# EAGLE design Proto FeatherWing (EAGLE 8.5.2)
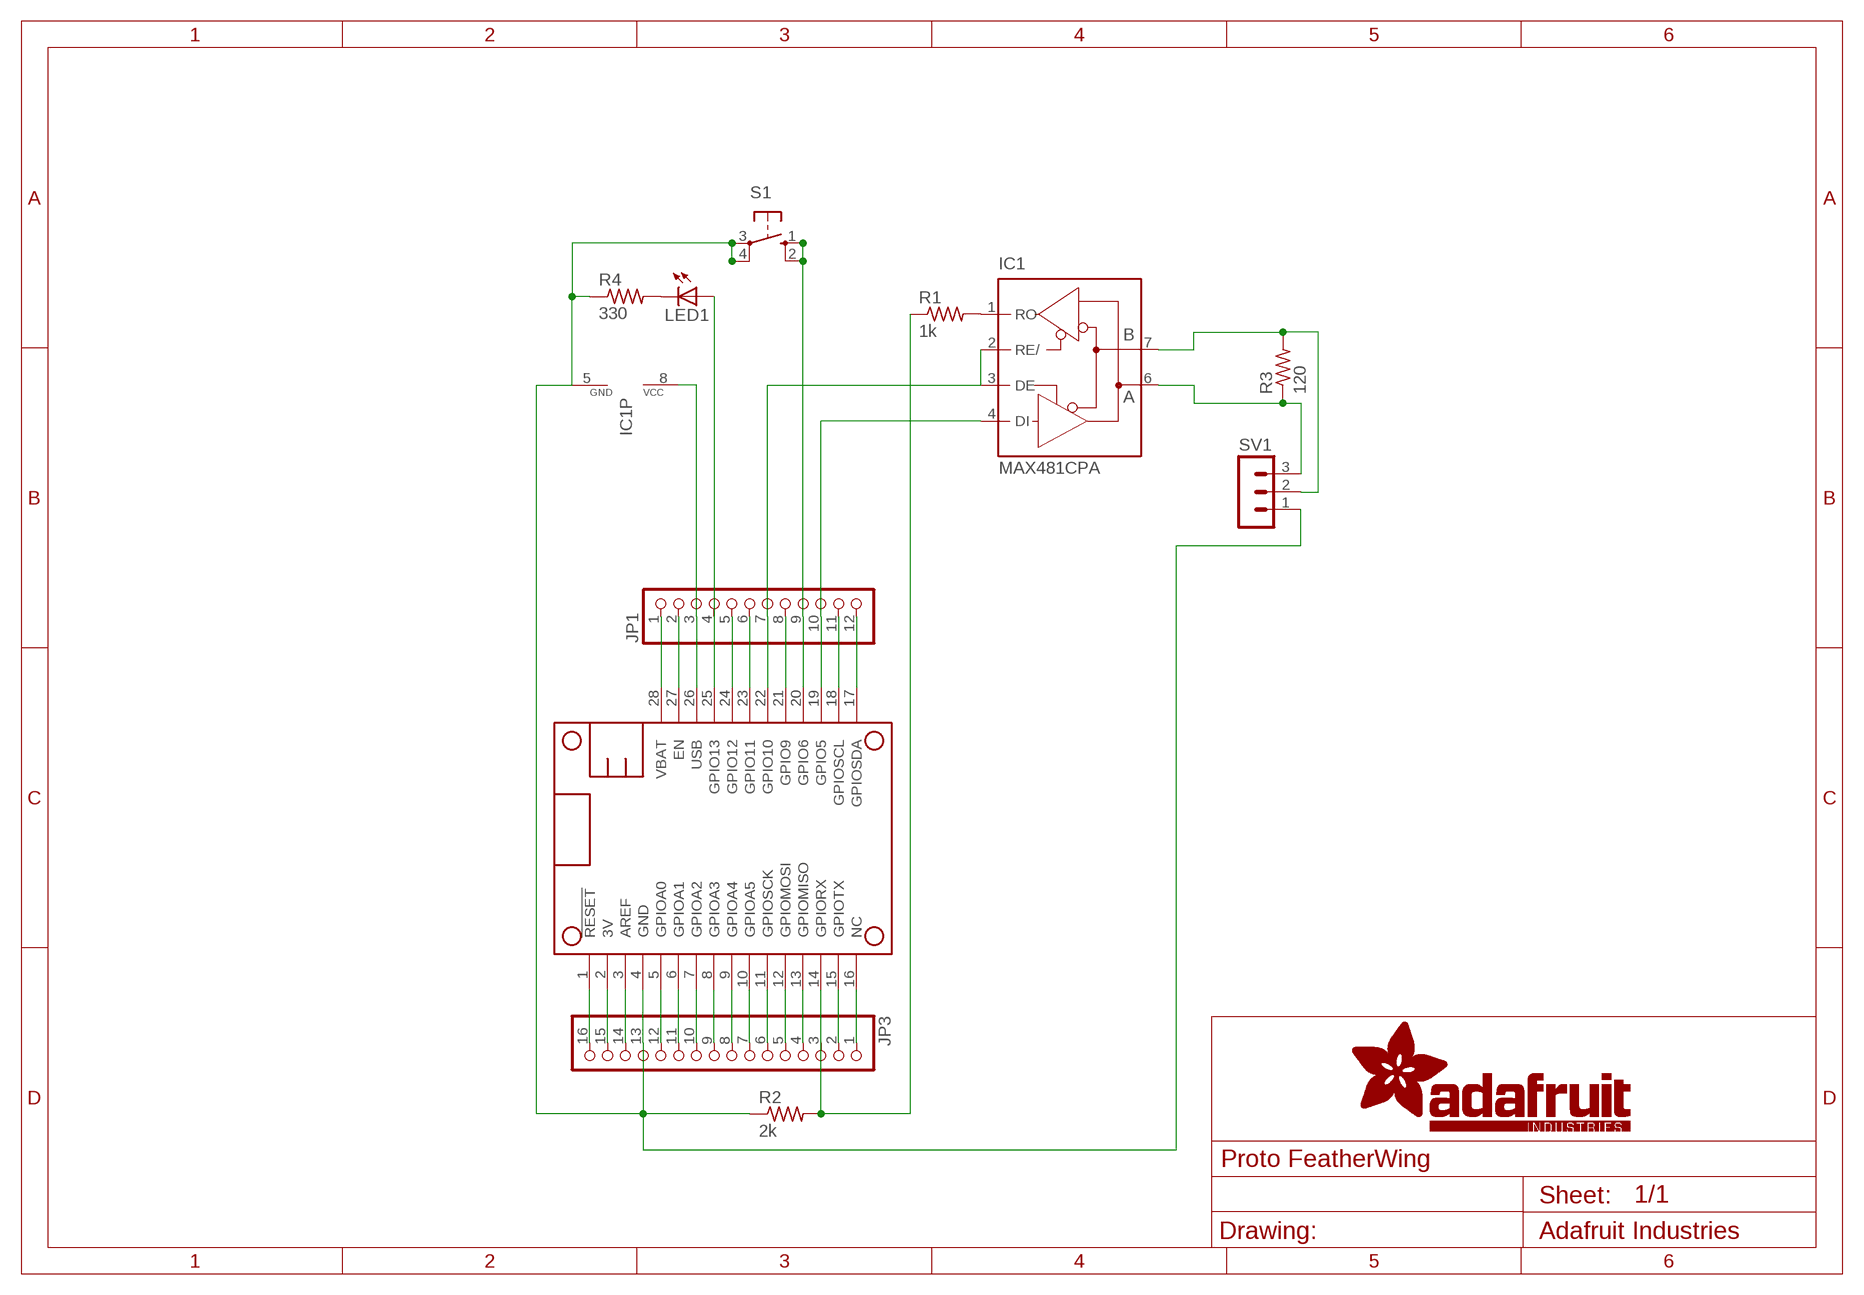
[diagram p0: schematic, sheet 1]

## Parts
IC1  MAX481CPA  [DIL08]
JP1  HEADER-1X1276MIL  [1X12_ROUND_76MIL]
JP3  HEADER-1X16_76MIL  [1X16_ROUND_76MIL]
LED1  LED5MM  [LED5MM]
MS1  FEATHERWING  [FEATHERWING]
R1  1k  R-US_0204/5  [0204/5]
R2  2k  R-US_0204/5  [0204/5]
R3  120  R-US_0204/5  [0204/5]
R4  330  R-US_0204/5  [0204/5]
S1  10-XX  [B3F-10XX]
SV1  MA03-1  [MA03-1]

## Nets
3V: JP3.15 MS1.2(3V)
AREF: JP3.14 MS1.3(AREF)
N$1: JP1.2 MS1.27(EN)
N$2: JP3.1 MS1.16(NC)
N$3: JP1.4 LED1.A MS1.25(GPIO13)
N$4: JP3.2 MS1.15(GPIOTX)
N$5: JP1.5 MS1.24(GPIO12)
N$6: JP3.3 MS1.14(GPIORX) R1.1 R2.2
N$7: JP3.4 MS1.13(GPIOMISO)
N$8: JP3.5 MS1.12(GPIOMOSI)
N$9: JP3.6 MS1.11(GPIOSCK)
N$10: JP3.7 MS1.10(GPIOA5)
N$11: JP3.8 MS1.9(GPIOA4)
N$12: JP3.9 MS1.8(GPIOA3)
N$13: JP3.10 MS1.7(GPIOA2)
N$14: JP3.11 MS1.6(GPIOA1)
N$15: JP3.12 MS1.5(GPIOA0)
N$16: IC1.1(RO) R1.2
N$17: IC1.6(A) R3.1 SV1.3
N$18: JP3.16 MS1.1(!RESET)
N$19: JP1.6 MS1.23(GPIO11)
N$20: IC1.4(DI) JP1.10 MS1.19(GPIO5)
N$21: JP1.8 MS1.21(GPIO9)
N$22: JP1.9 MS1.20(GPIO6) S1.1(S) S1.2(S1)
N$23: LED1.K(C) R4.2
N$24: JP1.11 MS1.18(GPIOSCL)
N$25: JP1.12 MS1.17(GPIOSDA)
N$26: IC1.5(GND) JP3.13 MS1.4(GND) R2.1 R4.1 S1.3(P) S1.4(P1) SV1.1
N$27: IC1.7(B) R3.2 SV1.2
N$28: IC1.2(RE/) IC1.3(DE) JP1.7 MS1.22(GPIO10)
USB: IC1.8(VCC) JP1.3 MS1.26(USB)
VBAT: JP1.1 MS1.28(VBAT)

## Library data of the parts
IC1 = maxim:MAX481CPA: RS485 TRANSEIVER; MPN: MAX481CPA+; OC_FARNELL: unknown; OC_NEWARK: 99K3445
JP1 = microbuilder:HEADER-1X12
JP3 = microbuilder:HEADER-1X16: PIN HEADER
LED1 = adafruit:LED: LED OSRAM: - CHIPLED LG R971, LG N971, LY N971, LG Q971, LY Q971, LO R971, LY R971 LH N974, LH R974 LS Q976, LO Q976, LY Q976 LO Q996 - Hyper CHIPLED LW Q18S LB Q993, LB Q99A, LB R99A - SideLED LS A670, LO A670, LY A670, LG A670, LP A670 LB A673, LV A673, LT A673, LW A673 LH A674 LY A675 LS A676, LA A676, LO A676, LY A676, LW A676 LS A679, LY A679, LG A679 - Hyper Micro SIDELED® LS Y876, LA Y876, LO Y876, LY Y876 LT Y87S - SmartLED LW L88C, LW L88S LB L89C, LB L89S, LG L890 LS L89K, LO L89K, LY L89K LS L896, LA L896, LO L896, LY L896 - TOPLED LS T670, LO T670, LY T670, LG T670, LP T670 LSG T670, LSP T670, LSY T670, LOP T670, LYG T670 LG T671, LOG T671, LSG T671 LB T673, LV T673, LT T673, LW T673 LH T674 LS T676, LA T676, LO T676, LY T676, LB T676, LH T676, LSB T676, LW T676 LB T67C, LV T67C, LT T67C, LS T67K, LO T67K, LY T67K, LW E67C LS E67B, LA E67B, LO E67B, LY E67B, LB E67C, LV E67C, LT E67C LW T67C LS T679, LY T679, LG T679 LS T770, LO T770, LY T770, LG T770, LP T770 LB T773, LV T773, LT T773, LW T773 LH T774 LS E675, LA E675, LY E675, LS T675 LS T776, LA T776, LO T776, LY T776, LB T776 LHGB T686 LT T68C, LB T68C - Hyper Mini TOPLED® LB M676 - Mini TOPLED Santana® LG M470 LS M47K, LO M47K, LY M47K Source: http://www.osram.convergy.de/
MS1 = microbuilder:FEATHERWING
R1-R4 = resistor:R-US_: RESISTOR, American symbol
S1 = switch-omron:10-XX: OMRON SWITCH; MPN: B3F-1000; OC_FARNELL: 176432; OC_NEWARK: 36M3542
SV1 = con-lstb:MA03-1: PIN HEADER; OC_FARNELL: unknown; OC_NEWARK: unknown

## Board
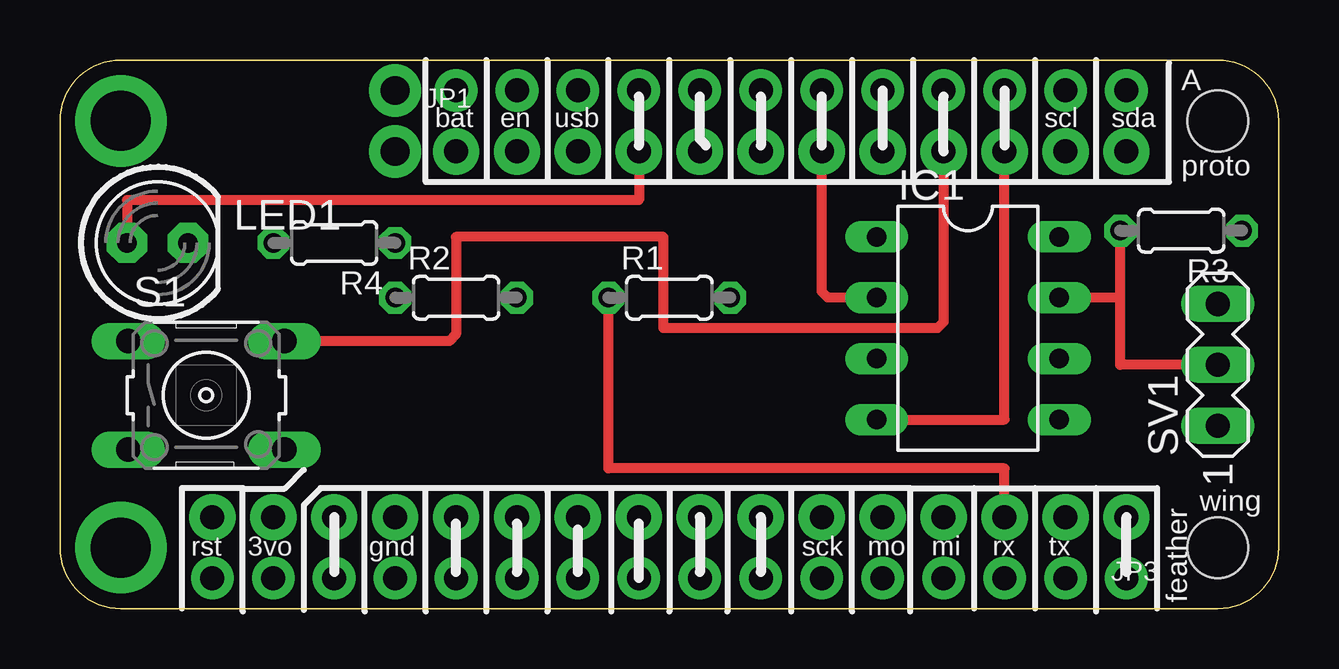
[diagram p1: board, top side]
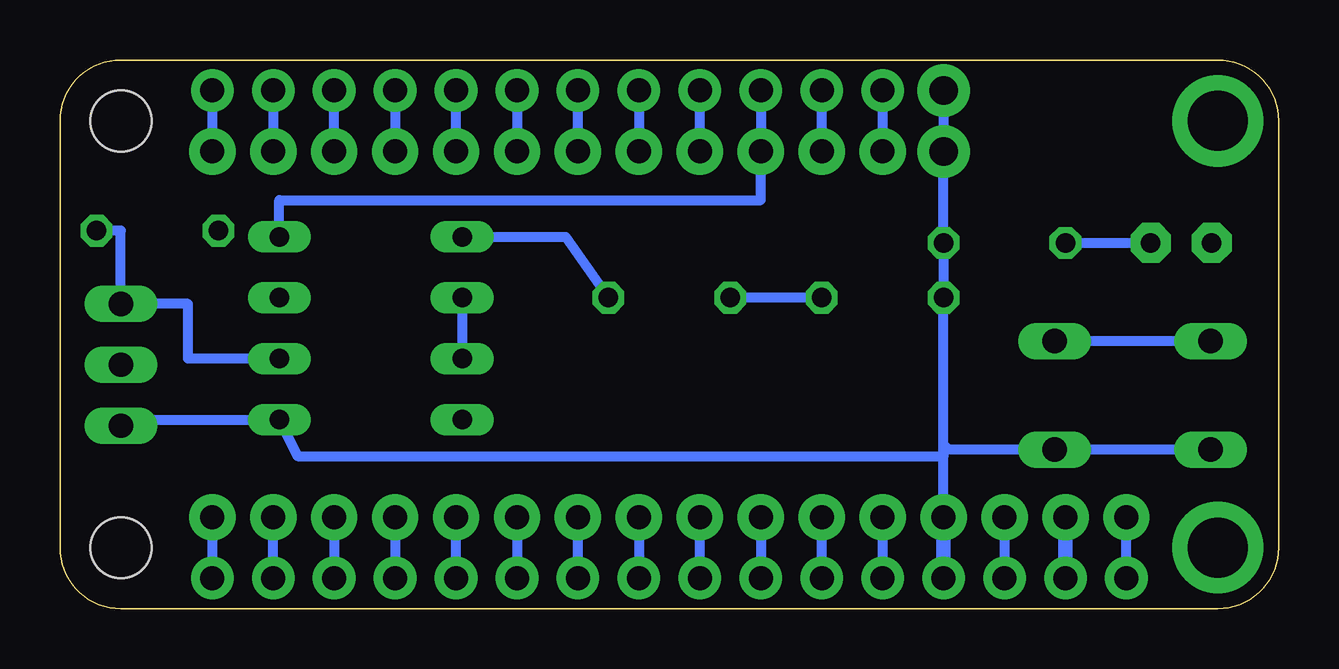
[diagram p2: board, bottom side, seen from below]

Size 50.8 x 22.86 mm. Coordinates in mm from the lower left corner, seen from the top.
Outline: 2.54,22.86 48.26,22.86 arc-90 50.8,20.32 50.8,2.54 arc-90 48.26,0 2.54,0 arc-90 0,2.54 0,20.32 arc-90 2.54,22.86
Copper layers (1*16): Top 0.035mm / dielectric 1.5mm / Bottom 0.035mm
Design rules "adafruit": minimum track width 8mil, minimum drill 15.5mil, track to track 8mil, track to pad 8mil, pad to pad 8mil, via to via 8mil, smd to smd 8mil, copper to edge 10mil, drill to drill 8mil, minimum pad ring 10mil, minimum via ring 8mil, stop-mask expansion 2mil, vias tented up to drill 20mil, thermal gap 10mil

### Footprints (pad centres in the part's own frame; a part is rotated, then mirrored left to right if it is on the bottom)
DIL08 = drill 0.813 long: 1 -3.81,-3.81; 2 -1.27,-3.81; 3 1.27,-3.81; 4 3.81,-3.81; 5 3.81,3.81; 6 1.27,3.81; 7 -1.27,3.81; 8 -3.81,3.81
1X12_ROUND_76MIL = drill 1 pad 1.93: 1 -13.97,0; 2 -11.43,0; 3 -8.89,0; 4 -6.35,0; 5 -3.81,0; 6 -1.27,0; 7 1.27,0; 8 3.81,0; 9 6.35,0; 10 8.89,0; 11 11.43,0; 12 13.97,0
1X16_ROUND_76MIL = drill 1 pad 1.93: 1 -19.05,0; 2 -16.51,0; 3 -13.97,0; 4 -11.43,0; 5 -8.89,0; 6 -6.35,0; 7 -3.81,0; 8 -1.27,0; 9 1.27,0; 10 3.81,0; 11 6.35,0; 12 8.89,0; 13 11.43,0; 14 13.97,0; 15 16.51,0; 16 19.05,0
LED5MM = drill 0.813 pad 1.676 octagon: A -1.27,0; K 1.27,0
FEATHERWING = drill 1 pad 1.778: 1 6.35,1.27; 2 8.89,1.27; 3 11.43,1.27; 4 13.97,1.27; 5 16.51,1.27; 6 19.05,1.27; 7 21.59,1.27; 8 24.13,1.27; 9 26.67,1.27; 10 29.21,1.27; 11 31.75,1.27; 12 34.29,1.27; 13 36.83,1.27; 14 39.37,1.27; 15 41.91,1.27; 16 44.45,1.27; 17 44.45,21.59; 18 41.91,21.59; 19 39.37,21.59; 20 36.83,21.59; 21 34.29,21.59; 22 31.75,21.59; 23 29.21,21.59; 24 26.67,21.59; 25 24.13,21.59; 26 21.59,21.59; 27 19.05,21.59; 28 16.51,21.59 | drill 2.5 pad 3.81: P$1 2.54,20.32; P$2 2.54,2.54 | hole 2.54: 48.26,20.32; 48.26,2.54
0204/5 = drill 0.813 octagon: 1 -2.54,0; 2 2.54,0
B3F-10XX = drill 1.016 long: 1 -3.251,2.261; 2 3.251,2.261; 3 -3.251,-2.261; 4 3.251,-2.261
MA03-1 = drill 1.016 long: 1 -2.54,0; 2 0,0; 3 2.54,0

### Placement (x,y rotation side)
IC1  37.85,11.68 270 top
JP1  30.48,19.05 0 top
JP3  25.4,3.81 180 top
LED1  4.06,15.24 0 top
MS1  0,0 0 top
R1  25.4,12.95 0 top
R2  16.51,12.95 0 top
R3  46.74,15.75 180 top
R4  11.43,15.24 180 top
S1  6.1,8.89 0 top
SV1  48.26,10.16 90 top

### Tracks (layer width: path | path; a pad name or v marks a point on that pad's centre or on a via)
3V
  Bottom 0.61: JP3.15 MS1.2
AREF
  Bottom 0.406: JP3.14 MS1.3
N$1
  Bottom 0.406: JP1.2 MS1.27
N$2
  Bottom 0.406: JP3.1 MS1.16
N$3
  Top 0.406: JP1.4 24.13,17.02 2.79,17.02 LED1.A
  Bottom 0.406: JP1.4 MS1.25
N$4
  Bottom 0.406: MS1.15 JP3.2
N$5
  Bottom 0.406: MS1.24 JP1.5
N$6
  Top 0.406: JP3.3 39.37,5.84 22.86,5.84 R1.1
  Bottom 0.406: JP3.3 MS1.14 | R2.2 R1.1
N$7
  Bottom 0.406: JP3.4 MS1.13
N$8
  Bottom 0.406: MS1.12 JP3.5
N$9
  Bottom 0.406: JP3.6 MS1.11
N$10
  Bottom 0.406: MS1.10 JP3.7
N$11
  Bottom 0.406: JP3.8 MS1.9
N$12
  Bottom 0.406: MS1.8 JP3.9
N$13
  Bottom 0.406: JP3.10 MS1.7
N$14
  Bottom 0.406: MS1.6 JP3.11
N$15
  Bottom 0.406: JP3.12 MS1.5
N$16
  Bottom 0.406: IC1.1 29.72,15.49 R1.2
N$17
  Bottom 0.406: R3.1 48.26,15.75 SV1.3 45.47,12.7 45.47,10.41 IC1.6
N$18
  Bottom 0.406: MS1.1 JP3.16
N$19
  Bottom 0.406: JP1.6 MS1.23
N$20
  Top 0.406: IC1.4 39.37,7.87 JP1.10
  Bottom 0.406: JP1.10 MS1.19
N$21
  Bottom 0.406: JP1.8 MS1.21
N$22
  Top 0.406: JP1.9 36.83,11.94 36.58,11.68 25.15,11.68 25.15,15.49 16.51,15.49 16.51,11.43 16.23,11.15 S1.2
  Bottom 0.406: MS1.20 JP1.9 | S1.1 S1.2
N$23
  Bottom 0.406: R4.2 LED1.K
N$24
  Bottom 0.406: MS1.18 JP1.11
N$25
  Bottom 0.406: MS1.17 JP1.12
N$26  (via drill 1.2 pad 2.18)
  Bottom 0.406: JP3.13 13.97,6.35 | 13.97,6.35 13.97,6.86 | 13.97,6.86 R2.1 R4.1 v13.97,19.05 v13.97,21.59 | 13.97,6.35 40.89,6.35 IC1.5 49.02,7.87 SV1.1 | S1.3 S1.4 13.74,6.63 13.97,6.86
  Bottom 0.61: JP3.13 MS1.4
N$27
  Top 0.406: SV1.2 44.2,10.16 44.2,12.95 | 44.2,12.95 R3.2 | 44.2,12.95 IC1.7
N$28
  Top 0.406: JP1.7 31.75,13.21 32,12.95 IC1.2
  Bottom 0.406: MS1.22 JP1.7 | IC1.2 IC1.3
USB
  Bottom 0.406: MS1.26 JP1.3 21.59,17.02 41.66,17.02 IC1.8
VBAT
  Bottom 0.406: MS1.28 JP1.1

### Text on the board
tPlace: A | bat | en | usb | scl | sda | proto | wing | rst | 3vo | gnd | sck | mo | mi | rx | tx | feather